# EasyEDA Pro project Flexbus_Cable - Flipped.eprj

# Schematic Schematic1
Create Date: 2024-02-22; Page Name: P1; Project Name: Flexbus_Cable - Flipped; Schematic Name: Schematic1; Update Date: 2024-02-22; Company: EasyEDA.com; Drawn: EasyEDA; Page Size: A4; Part Number: JLCPCB-002; Reviewed: EasyEDA; Version: V0.1
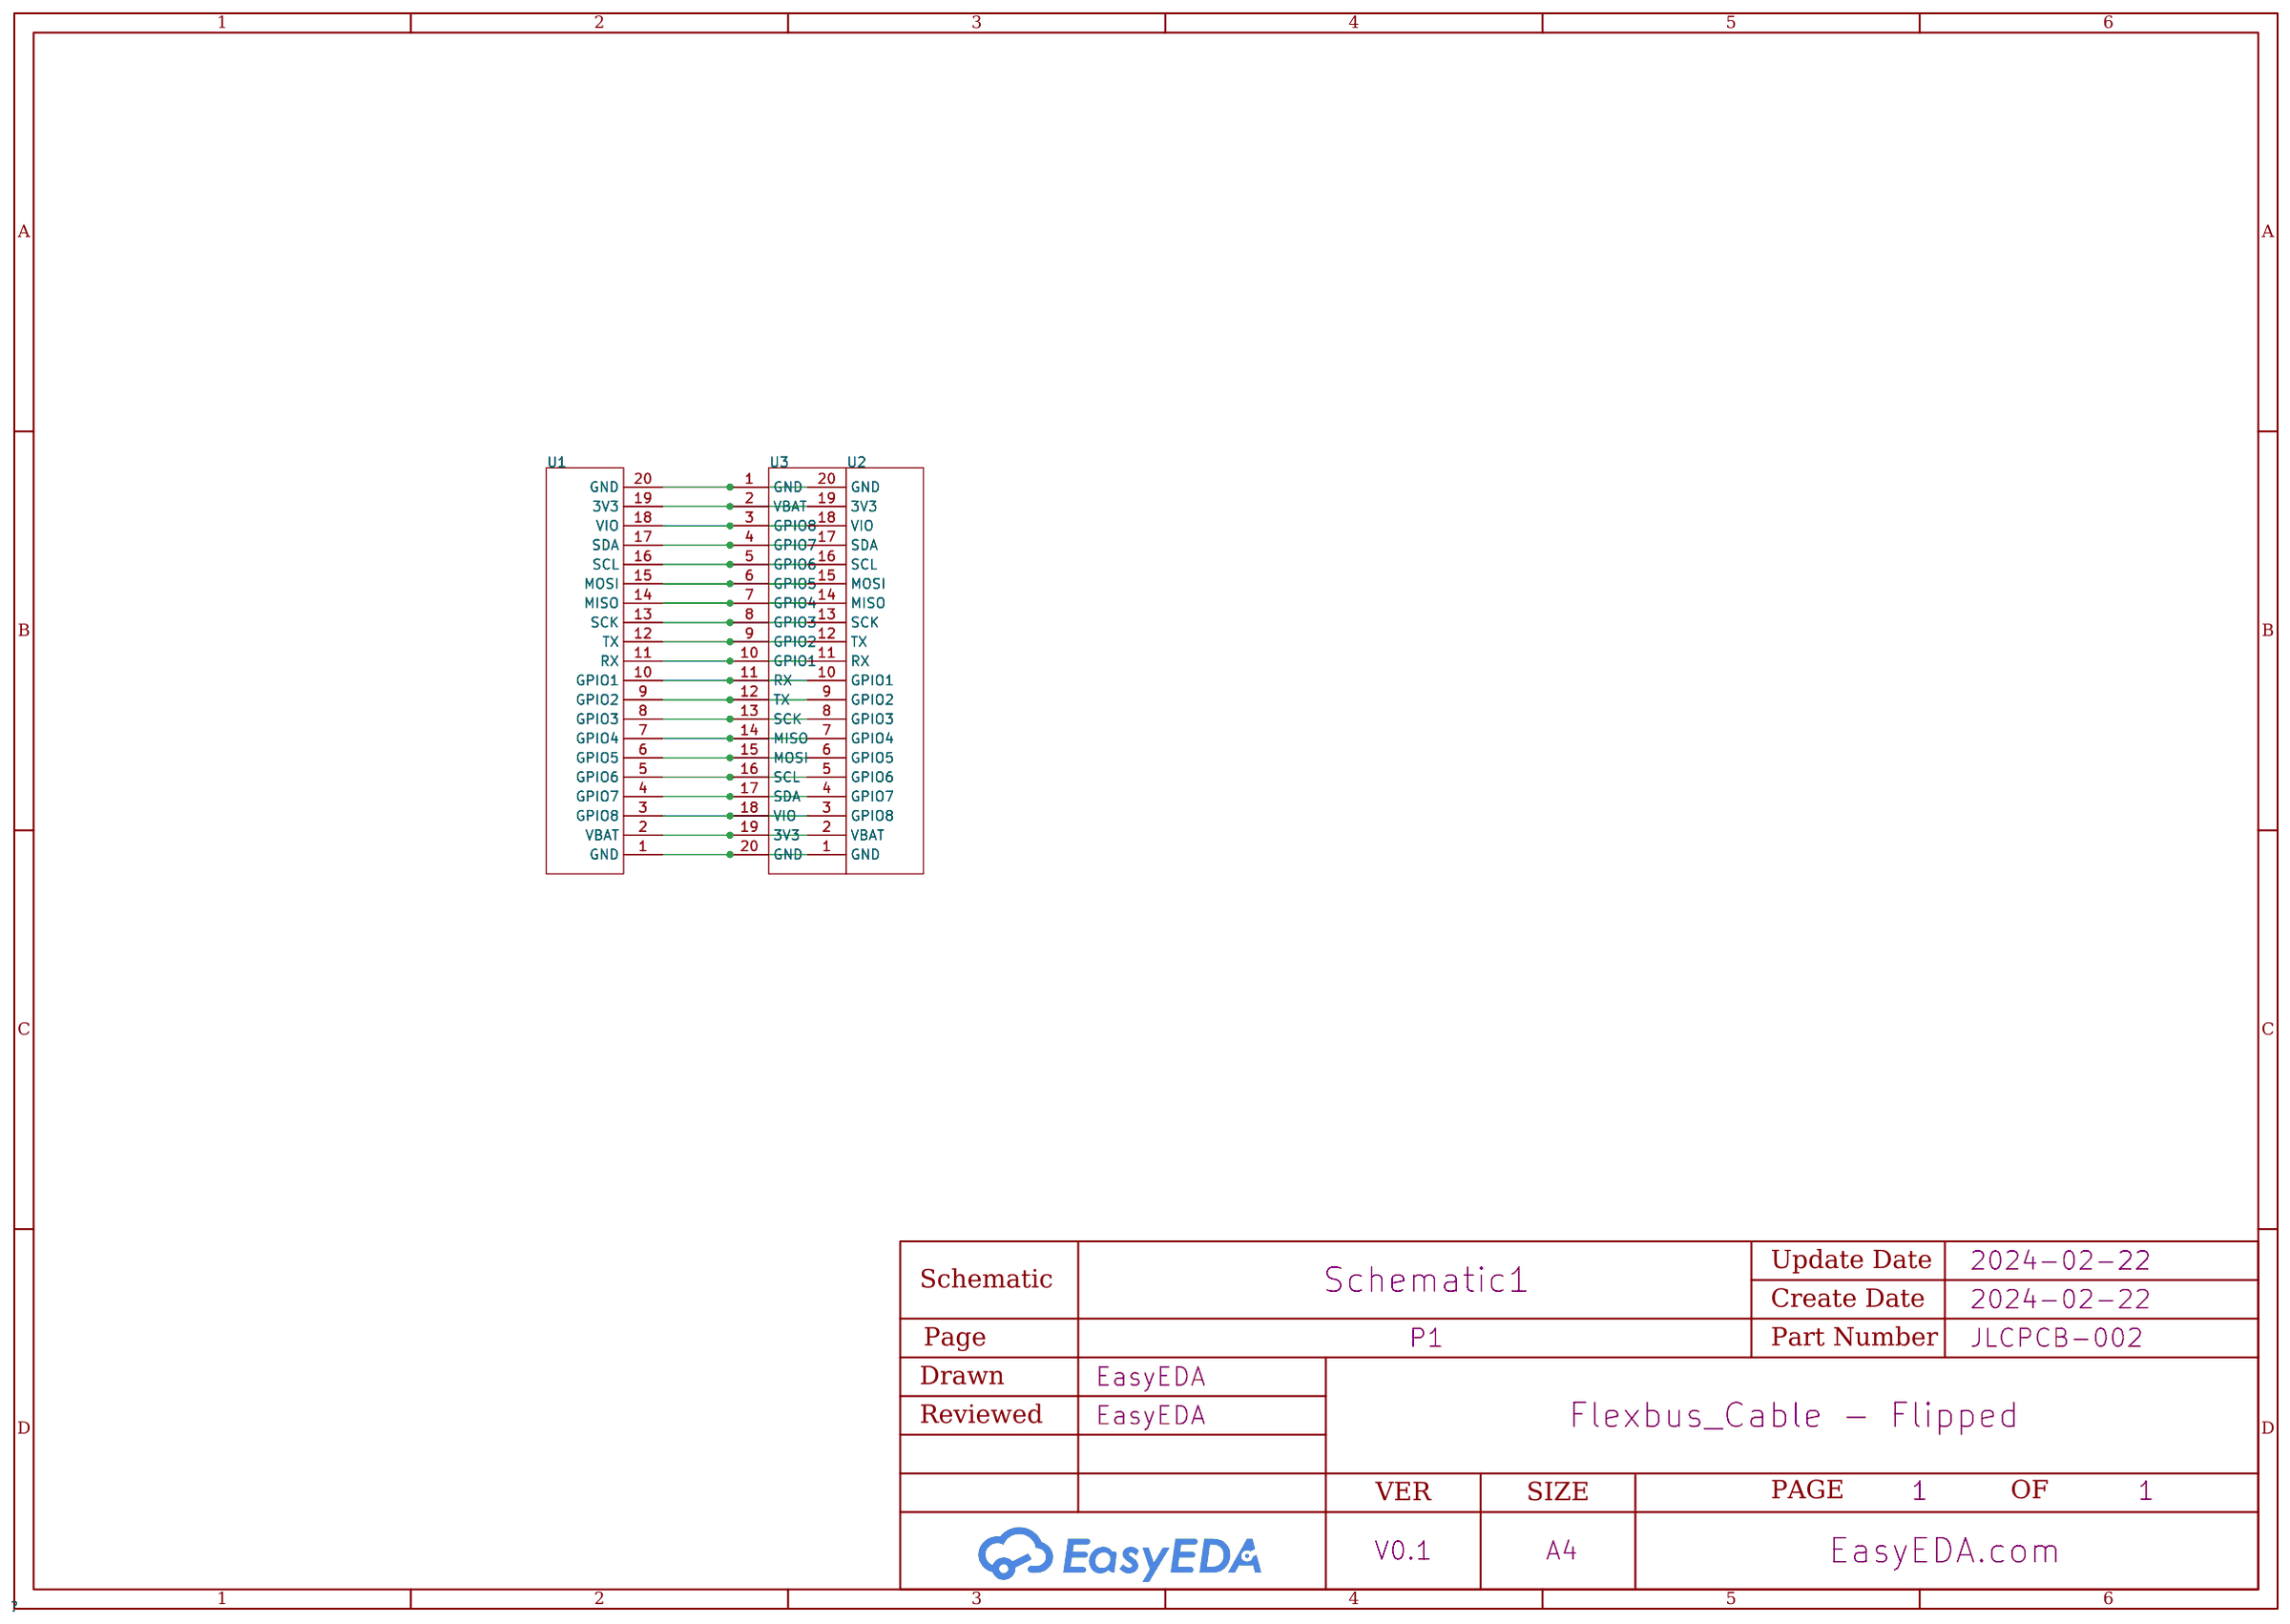
[diagram p0: schematic sheet]

## Parts
U1  -  [FPC 0.5mm 20P]
U2  -  [FPC 0.5mm 20P]
U3  -  [FPC 0.5mm 20P]

## Library data of the parts
U1-U3 = FlexBus FPC 0.5mm 20P

## Nets
Net-(U1-1): U1.1(GND) U2.1(GND) U3.20(GND)
Net-(U1-2): U1.2(VBAT) U2.2(VBAT) U3.19(3V3)
Net-(U1-3): U1.3(GPIO8) U2.3(GPIO8) U3.18(VIO)
Net-(U1-4): U1.4(GPIO7) U2.4(GPIO7) U3.17(SDA)
Net-(U1-5): U1.5(GPIO6) U2.5(GPIO6) U3.16(SCL)
Net-(U1-6): U1.6(GPIO5) U2.6(GPIO5) U3.15(MOSI)
Net-(U1-7): U1.7(GPIO4) U2.7(GPIO4) U3.14(MISO)
Net-(U1-8): U1.8(GPIO3) U2.8(GPIO3) U3.13(SCK)
Net-(U1-9): U1.9(GPIO2) U2.9(GPIO2) U3.12(TX)
Net-(U1-10): U1.10(GPIO1) U2.10(GPIO1) U3.11(RX)
Net-(U1-11): U1.11(RX) U2.11(RX) U3.10(GPIO1)
Net-(U1-12): U1.12(TX) U2.12(TX) U3.9(GPIO2)
Net-(U1-13): U1.13(SCK) U2.13(SCK) U3.8(GPIO3)
Net-(U1-14): U1.14(MISO) U2.14(MISO) U3.7(GPIO4)
Net-(U1-15): U1.15(MOSI) U2.15(MOSI) U3.6(GPIO5)
Net-(U1-16): U1.16(SCL) U2.16(SCL) U3.5(GPIO6)
Net-(U1-17): U1.17(SDA) U2.17(SDA) U3.4(GPIO7)
Net-(U1-18): U1.18(VIO) U2.18(VIO) U3.3(GPIO8)
Net-(U1-19): U1.19(3V3) U2.19(3V3) U3.2(VBAT)
Net-(U1-20): U1.20(GND) U2.20(GND) U3.1(GND)

# Board PCB1
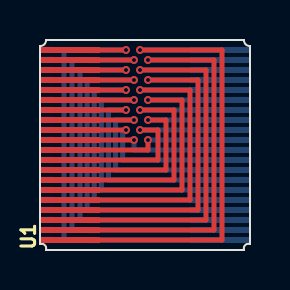
[diagram p1: board, top side]
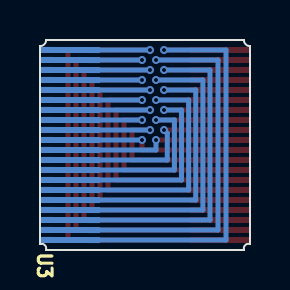
[diagram p2: board, bottom side, seen from below]

Outline 10.5 x 10.5 mm; copper layers: Top Layer, Bottom Layer. Coordinates in mm from the lower left corner of the outline.
Outline path: 3,10.5 7.5,10.5 ; 7.5,0 3,0
Stack: Top Layer 0.012mm / Dielectric1 0.025mm FR4 er 4.5 / Bottom Layer 0.012mm

## Design rules (mm)
template: Custom Config
spacing copperThickness1oz (default): track to track 0.102, other pairs 0.152 to 0.3
spacing copperThickness2oz: track to track 0.203, other pairs 0.152 to 0.3
track width copperThickness1oz (default): min 0.127, default 0.254, max 2.54
track width copperThickness2oz: min 0.203, default 0.254, max 2.54
differential pair differentialPair (default): width min 0.127, default 0.254, max 2.54; gap min 0.152, default 0.152
via viaSize (default): diameter min 0.4, default 0.61, max 10; hole min 0.2, default 0.305, max 6.3

## Placement (name value [footprint] x y rotation side)
U1  -  [FPC 0.5mm 20P]  3 0 90 top
U3  -  [FPC 0.5mm 20P]  7.5 0 90 bottom

## Footprints (pads in the part's own frame, mm; a bottom-side part is the same pattern mirrored in y, then rotated)
FPC 0.5mm 20P
  custom 0.305x3 smd: 1(0.5,1.5) 2(1,1.5) 3(1.5,1.5) 4(2,1.5) 5(2.5,1.5) 6(3,1.5) 7(3.5,1.5) 8(4,1.5) 9(4.5,1.5) 10(5,1.5) 11(5.5,1.5) 12(6,1.5) 13(6.5,1.5) 14(7,1.5) 15(7.5,1.5) 16(8,1.5) 17(8.5,1.5) 18(9,1.5) 19(9.5,1.5) 20(10,1.5)

## Nets
$1N187: U1.1 U3.20
$1N189: U1.2 U3.19
$1N191: U1.3 U3.18
$1N193: U1.4 U3.17
$1N195: U1.5 U3.16
$1N197: U1.6 U3.15
$1N199: U1.7 U3.14
$1N201: U1.8 U3.13
$1N203: U1.9 U3.12
$1N205: U1.10 U3.11
$1N207: U1.11 U3.10
$1N209: U1.12 U3.9
$1N211: U1.13 U3.8
$1N213: U1.14 U3.7
$1N215: U1.15 U3.6
$1N217: U1.16 U3.5
$1N219: U1.17 U3.4
$1N221: U1.18 U3.3
$1N223: U1.19 U3.2
$1N225: U1.20 U3.1

## Via types
v1: diameter 0.4, hole 0.2, Top Layer to Bottom Layer, 20 vias

## Routing (per net, layer and track width the routed paths; a pad name or vN(x,y) marks a point on that pad's centre or on a via; arc(x,y) is an arc through that point)
$1N187: length 23.9
  Top Layer w0.254: v1(5,10) 9.1,10 9.1,0.5 2.5,0.5
  Bottom Layer w0.254: v1(5,10) 8.7,10
$1N189: length 21.3
  Top Layer w0.254: 2.5,1 8.7,1 8.7,9.5 v1(5.4,9.5)
  Bottom Layer w0.254: v1(5.4,9.5) 8.7,9.5
$1N191: length 20.3
  Top Layer w0.254: 2.5,1.5 8.3,1.5 8.3,9 v1(5,9)
  Bottom Layer w0.254: v1(5,9) 8.7,9
$1N193: length 17.6
  Top Layer w0.254: v1(5.4,8.5) 7.9,8.5 7.9,2 2.5,2
  Bottom Layer w0.254: v1(5.4,8.5) 8.6,8.5
$1N195: length 16.6
  Top Layer w0.254: 2.5,2.5 7.5,2.5 7.5,8 v1(5,8)
  Bottom Layer w0.254: v1(5,8) 8.6,8
$1N197: length 14.1
  Top Layer w0.254: v1(5.4,7.5) 7.1,7.5 7.1,3 2.5,3
  Bottom Layer w0.254: v1(5.4,7.5) 8.7,7.5
$1N199: length 13
  Top Layer w0.254: 2.5,3.5 6.7,3.5 6.7,7 v1(5,7)
  Bottom Layer w0.254: v1(5,7) 8.6,7
$1N201: length 10.3
  Top Layer w0.254: 2.6,4 6.3,4 6.3,6.5 v1(5.4,6.5)
  Bottom Layer w0.254: v1(5.4,6.5) 8.6,6.5
$1N203: length 9.5
  Top Layer w0.254: v1(5,6) 5.9,6 5.9,4.5 2.5,4.5
  Bottom Layer w0.254: v1(5,6) 8.7,6
$1N205: length 6.6
  Top Layer w0.254: 2.5,5 5.4,5 v1(5.4,5.5)
  Bottom Layer w0.254: v1(5.4,5.5) 8.6,5.5
$1N207: length 6.7
  Top Layer w0.254: v1(4.7,5.5) 2.5,5.5
  Bottom Layer w0.254: 8.7,5 4.7,5 v1(4.7,5.5)
$1N209: length 7.9
  Top Layer w0.254: v1(4.3,6) 2.5,6
  Bottom Layer w0.254: 8.7,4.5 4.13,4.5 4.13,5.83 v1(4.3,6)
$1N211: length 10.5
  Top Layer w0.254: v1(4.7,6.5) 2.5,6.5
  Bottom Layer w0.254: 8.7,4 3.78,4 3.78,6.5 v1(4.7,6.5)
$1N213: length 11.5
  Top Layer w0.254: v1(4.3,7) 2.5,7
  Bottom Layer w0.254: v1(4.3,7) 3.42,7 3.42,3.5 8.7,3.5
$1N215: length 14
  Top Layer w0.254: v1(4.7,7.5) 2.5,7.5
  Bottom Layer w0.254: 8.7,3 3.07,3 3.07,7.5 v1(4.7,7.5)
$1N217: length 14.9
  Top Layer w0.254: v1(4.3,8) 2.5,8
  Bottom Layer w0.254: v1(4.3,8) 2.71,8 2.71,2.5 8.7,2.5
$1N219: length 17.4
  Top Layer w0.254: v1(4.7,8.5) 2.5,8.5
  Bottom Layer w0.254: v1(4.7,8.5) 2.36,8.5 2.36,2 8.7,2
$1N221: length 18.3
  Top Layer w0.254: v1(4.3,9) 2.5,9
  Bottom Layer w0.254: v1(4.3,9) 2,9 2,1.5 8.7,1.5
$1N223: length 20.9
  Top Layer w0.254: v1(4.7,9.5) 2.5,9.5
  Bottom Layer w0.254: v1(4.7,9.5) 1.6,9.5 1.6,1 8.7,1
$1N225: length 21.9
  Top Layer w0.254: v1(4.3,10) 2.5,10
  Bottom Layer w0.254: 8.7,0.5 1.2,0.5 1.2,10 v1(4.3,10)
